# EAGLE schematic Sendeeinheit (EAGLE 7.7.0)
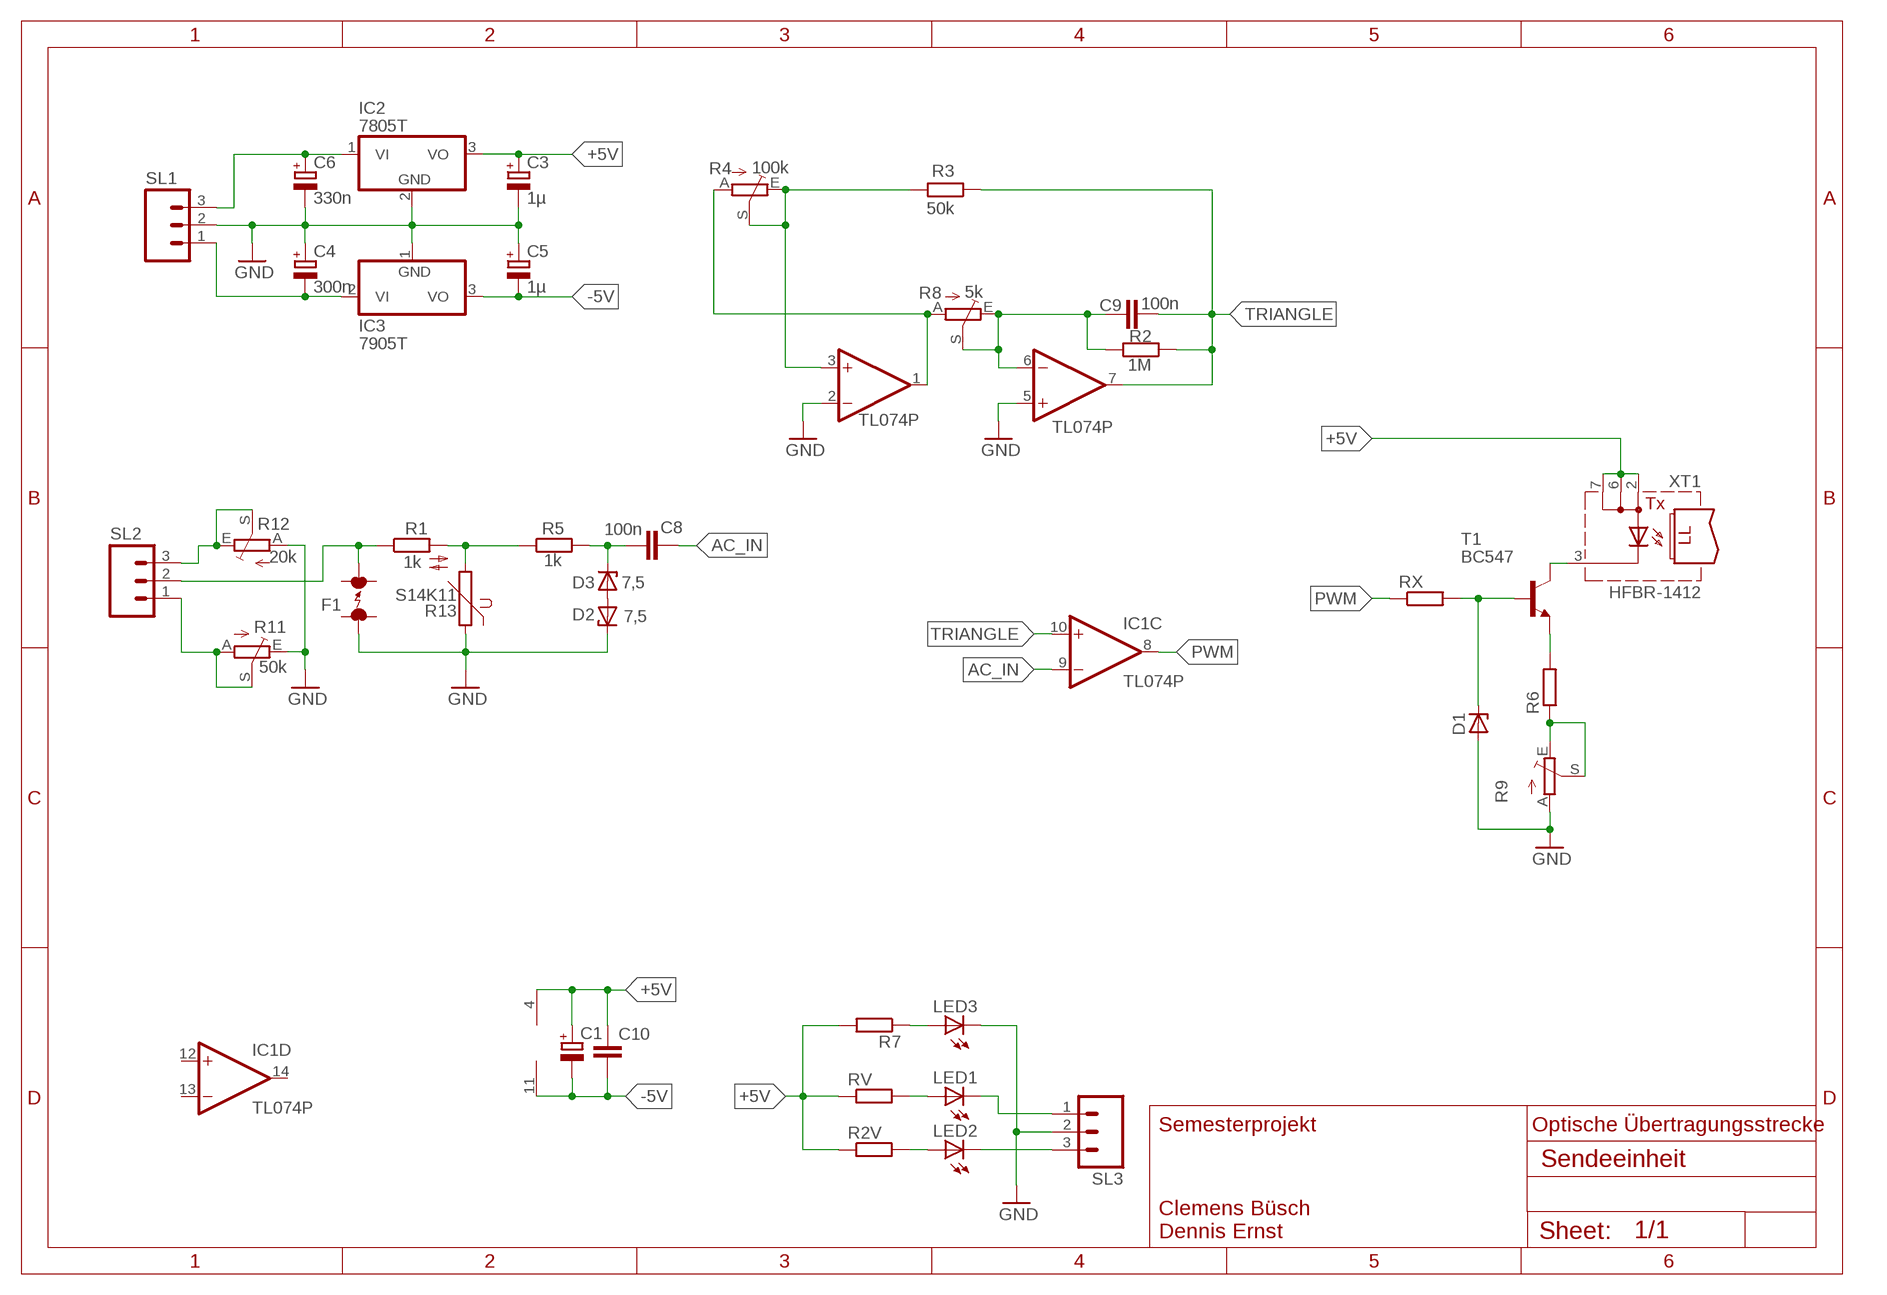
[diagram p0: schematic, sheet 1]

## Parts
C1  CPOL-EUE5-10.5  [E5-10,5]
C3  1µ  CPOL-EUE5-10.5  [E5-10,5]
C4  300n  CPOL-EUE5-10.5  [E5-10,5]
C5  1µ  CPOL-EUE5-10.5  [E5-10,5]
C6  330n  CPOL-EUE5-10.5  [E5-10,5]
C8  100n  C-EU050-024X044  [C050-024X044]
C9  100n  C-EU050-024X044  [C050-024X044]
C10  C-EU050-024X044  [C050-024X044]
D1  ZENER-DIODEDO35Z10  [DO35Z10]
D2  7,5  ZENER-DIODEDO35Z10  [DO35Z10]
D3  7,5  ZENER-DIODEDO35Z10  [DO35Z10]
F1  ARRESTER  [EPCOS_N81]
IC1  TL074P  [DIL14]
IC2  7805T  [TO220H]
IC3  7905T  7908T  [TO220H]
LED1  LED3MM  [LED3MM]
LED2  LED3MM  [LED3MM]
LED3  LED3MM  [LED3MM]
R1  1k  R-EU_0207/10  [0207/10]
R2  1M  R-EU_0207/10  [0207/10]
R2V  R-EU_0207/10  [0207/10]
R3  50k  R-EU_0207/10  [0207/10]
R4  100k  TRIM_EU-RJ9W  [RJ9W]
R5  1k  R-EU_0207/10  [0207/10]
R6  R-EU_0207/10  [0207/10]
R7  R-EU_0207/10  [0207/10]
R8  5k  TRIM_EU-RJ9W  [RJ9W]
R9  TRIM_EU-RJ9W  [RJ9W]
R11  50k  TRIM_EU-RJ9W  [RJ9W]
R12  20k  TRIM_EU-RJ9W  [RJ9W]
R13  S14K11  [S14K11]
RV  R-EU_0207/10  [0207/10]
RX  R-EU_0207/10  [0207/10]
SL1  M03  [03P]
SL2  M03  [03P]
SL3  M03  [03P]
T1  BC547  [TO92]
XT1  HFBR-1412  [HFBR-X41X]

## Nets
+5V: C1.+ C3.+ C10.1 IC1.4(P:V+) IC2.3(VO) R2V.1 R7.2 RV.1 XT1.2(A) XT1.6(A1) XT1.7(A2)
-5V: C1.- C5.- C10.2 IC1.11(P:V-) IC3.3(VO)
AC_IN: C8.2 IC1.9(C:-IN)
GND: C3.- C4.+ C5.+ C6.- D1.A D2.C F1.1 IC1.2(A:-IN) IC1.5(B:+IN) IC2.2(GND) IC3.1(GND) LED3.K(C) R9.A R11.E R12.A R13.1 SL1.2 SL3.2
N$1: C6.+ IC2.1(VI) SL1.3
N$2: C4.- IC3.2(VI) SL1.1
N$3: R12.E R12.S SL2.3
N$4: R11.A R11.S SL2.1
N$5: F1.2 R1.1 SL2.2
N$7: D2.A D3.A
N$8: R1.2 R5.1 R13.2
N$9: C8.1 D3.C R5.2
N$10: C9.2 IC1.6(B:-IN) R2.2 R8.E R8.S
N$12: LED2.K(C) SL3.3
N$13: LED1.K(C) SL3.1
N$14: LED2.A R2V.2
N$15: LED1.A RV.2
N$16: LED3.A R7.1
N$17: IC1.1(A:OUT) R4.A R8.A
N$18: IC1.3(A:+IN) R3.2 R4.E R4.S
N$19: T1.3(C) XT1.3(C)
N$20: D1.C RX.2 T1.2(B)
N$21: R6.2 T1.1(E)
N$22: R6.1 R9.E R9.S
PWM: IC1.8(C:OUT) RX.1
TRIANGLE: C9.1 IC1.7(B:OUT) IC1.10(C:+IN) R2.1 R3.1
Unconnected: IC1.12(D:+IN) IC1.13(D:-IN) IC1.14(D:OUT)

## Notes on the sheet
- Semesterprojekt | Optische Übertragungsstrecke
- Clemens Büsch
  Dennis Ernst

## Library data of the parts
C1 C3-C6 = rcl:CPOL-EU: POLARIZED CAPACITOR, European symbol
C8-C10 = rcl:C-EU: CAPACITOR, European symbol
D1-D3 = diode:ZENER-DIODE: Z-Diode
F1 = discrete:ARRESTER: GASENTLADUNGSABLEITER 90V 10KA DC-Überschlag: 90V; Spannung, Impulsüberschlag: < 600V; Strom, Pulsentlastung, max.: 10kA Source: http://de.farnell.com .. 4025.pdf
IC1 = linear:TL074: OP AMP
IC2 = linear:78*: Positive VOLTAGE REGULATOR Source: http://cache.national.com/ds/LM/LM78L05.pdf http://www.fairchildsemi.com/ds/LM/LM7805.pdf
IC3 = linear:79*: Negative VOLTAGE REGULATOR
LED1-LED3 = led:LED: LED OSRAM: - CHIPLED LG R971, LG N971, LY N971, LG Q971, LY Q971, LO R971, LY R971 LH N974, LH R974 LS Q976, LO Q976, LY Q976 LO Q996 - Hyper CHIPLED LW Q18S LB Q993, LB Q99A, LB R99A - SideLED LS A670, LO A670, LY A670, LG A670, LP A670 LB A673, LV A673, LT A673, LW A673 LH A674 LY A675 LS A676, LA A676, LO A676, LY A676, LW A676 LS A679, LY A679, LG A679 - Hyper Micro SIDELED® LS Y876, LA Y876, LO Y876, LY Y876 LT Y87S - SmartLED LW L88C, LW L88S LB L89C, LB L89S, LG L890 LS L89K, LO L89K, LY L89K LS L896, LA L896, LO L896, LY L896 - TOPLED LS T670, LO T670, LY T670, LG T670, LP T670 LSG T670, LSP T670, LSY T670, LOP T670, LYG T670 LG T671, LOG T671, LSG T671 LB T673, LV T673, LT T673, LW T673 LH T674 LS T676, LA T676, LO T676, LY T676, LB T676, LH T676, LSB T676, LW T676 LB T67C, LV T67C, LT T67C, LS T67K, LO T67K, LY T67K, LW E67C LS E67B, LA E67B, LO E67B, LY E67B, LB E67C, LV E67C, LT E67C LW T67C LS T679, LY T679, LG T679 LS T770, LO T770, LY T770, LG T770, LP T770 LB T773, LV T773, LT T773, LW T773 LH T774 LS E675, LA E675, LY E675, LS T675 LS T776, LA T776, LO T776, LY T776, LB T776 LHGB T686 LT T68C, LB T68C - Hyper Mini TOPLED® LB M676 - Mini TOPLED Santana® LG M470 LS M47K, LO M47K, LY M47K Source: http://www.osram.convergy.de LUXEON: - LUMILED® LXK2-PW12-R00, LXK2-PW12-S00, LXK2-PW14-U00, LXK2-PW14-V00 LXK2-PM12-R00, LXK2-PM12-S00, LXK2-PM14-U00 LXK2-PE12-Q00, LXK2-PE12-R00, LXK2-PE12-S00, LXK2-PE14-T00, LXK2-PE14-U00 LXK2-PB12-K00, LXK2-PB12-L00, LXK2-PB12-M00, LXK2-PB14-N00, LXK2-PB14-P00, LXK2-PB14-Q00 LXK2-PR12-L00, LXK2-PR12-M00, LXK2-PR14-Q00, LXK2-PR14-R00 LXK2-PD12-Q00, LXK2-PD12-R00, LXK2-PD12-S00 LXK2-PH12-R00, LXK2-PH12-S00 LXK2-PL12-P00, LXK2-PL12-Q00, LXK2-PL12-R00 Source: www.luxeon.com KINGBRIGHT: KA-3528ASYC Source: www.kingbright.com
R1 R2 R2V R3 R5-R7 RV RX = rcl:R-EU_: RESISTOR, European symbol
R4 R8 R9 R11 R12 = pot:TRIM_EU-: POTENTIOMETER
R13 = varistor:S14K11: VARISTOR
SL1-SL3 = con-amp-quick:M03: AMP QUICK CONNECTOR; OC_FARNELL: unknown; OC_NEWARK: unknown
T1 = transistor:BC547: NPN TRANSISTOR
XT1 = fiber-optic-hp:HFBR-1412: TRANSMITTER low cost miniature fiber optic component, ST housed, TX standard power; MF: AGILENT TECHNOLOGIES; MPN: HFBR-1412; OC_FARNELL: 1173153; OC_NEWARK: 06F6037